# Altium project ADRF6510.PrjPcb
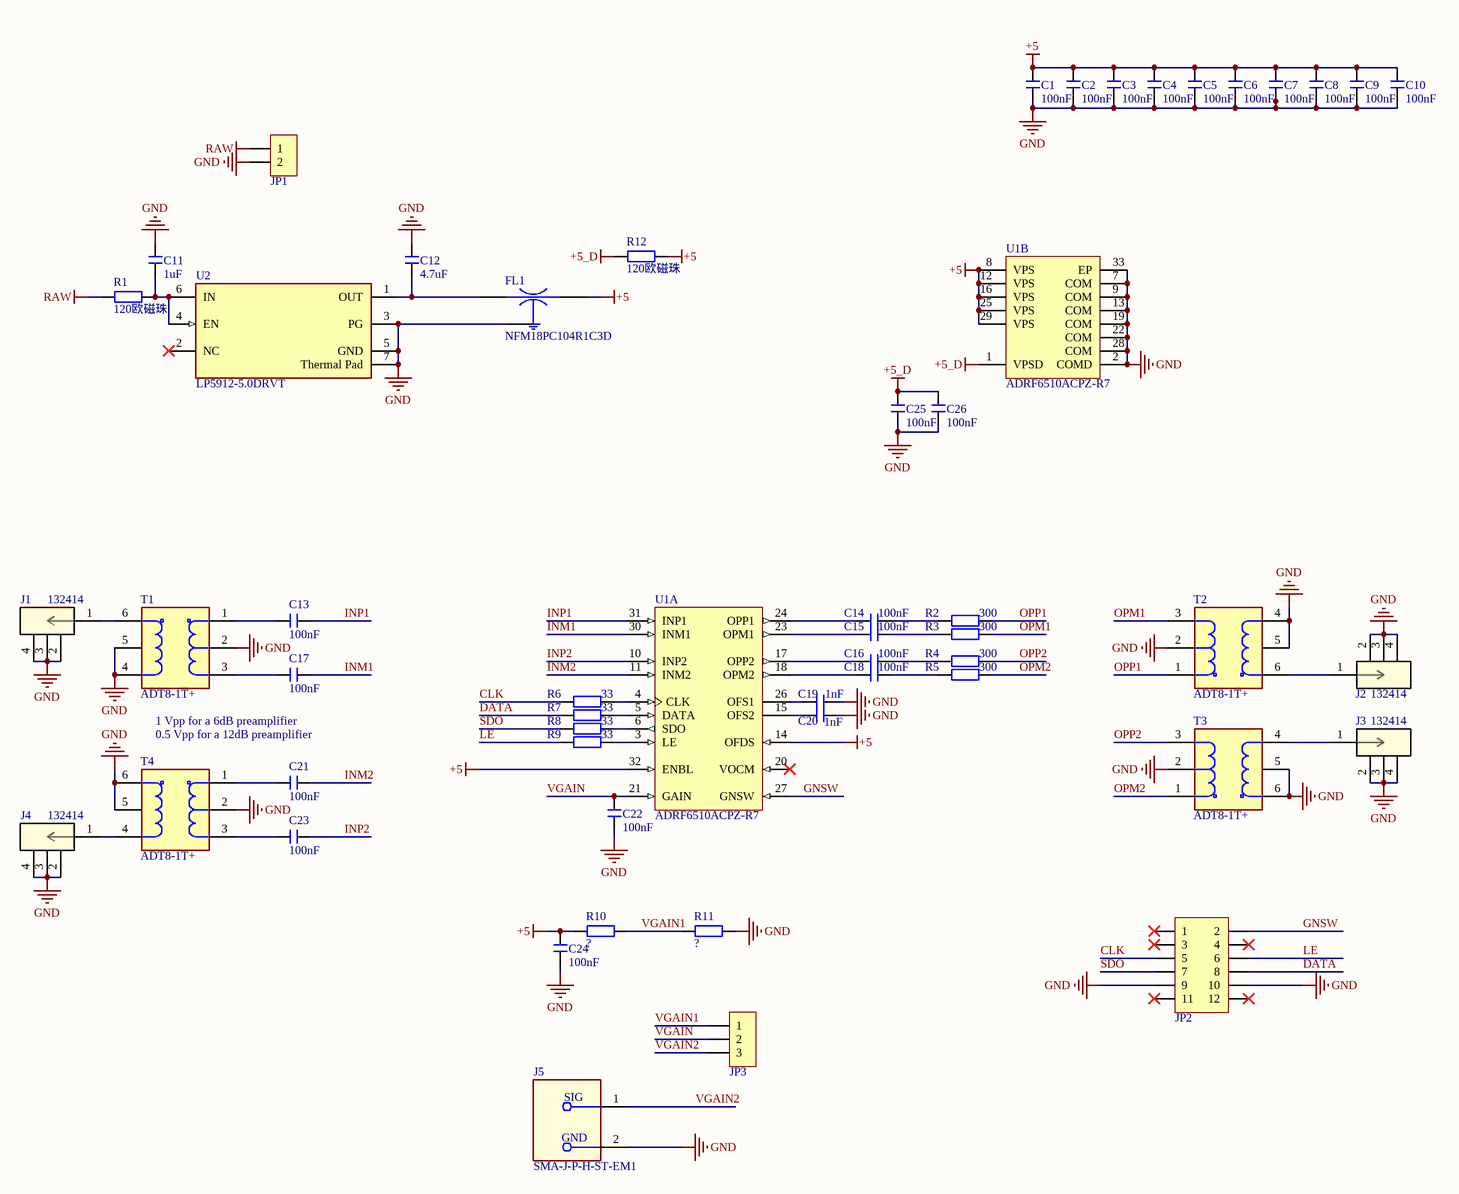
[diagram p0: ADRF6510.SchDoc]
1 sheet, 53 parts. Net scope: global (net labels, ports and power ports of the same name join across sheets).
Board file: ADRF6510.PcbDoc

## Sheet ADRF6510.SchDoc
size A2; SheetNumber: 1; SheetTotal: 1

### Parts
C1  100nF  [C 0402_L]
C2  100nF  [C 0402_L]
C3  100nF  [C 0402_L]
C4  100nF  [C 0402_L]
C5  100nF  [C 0402_L]
C6  100nF  [C 0402_L]
C7  100nF  [C 0402_L]
C8  100nF  [C 0402_L]
C9  100nF  [C 0402_L]
C10  100nF  [C 0402_L]
C11  1uF  [C 0603_L]
C12  4.7uF  [C 0603_L]
C13  100nF  [C 0402_L]
C14  100nF  [C 0402_L]
C15  100nF  [C 0402_L]
C16  100nF  [C 0402_L]
C17  100nF  [C 0402_L]
C18  100nF  [C 0402_L]
C19  1nF  [C 0402_L]
C20  1nF  [C 0402_L]
C21  100nF  [C 0402_L]
C22  100nF  [C 0402_L]
C23  100nF  [C 0402_L]
C24  100nF  [C 0402_L]
C25  100nF  [C 0402_L]
C26  100nF  [C 0402_L]
FL1  NFM18PC104R1C3D  [FIL_NFM18PC104R1C3D]
J1  132414  [CONN_132414_AMP]
J2  132414  [CONN_132414_AMP]
J3  132414  [CONN_132414_AMP]
J4  132414  [CONN_132414_AMP]
J5  SMA-J-P-H-ST-EM1  [FP-SMA-J-P-H-ST-EM1-MFG]
JP1  HDR-1X2  [KF2510-LI-2P]  (value not drawn)
JP2  Header 6X2  [HDR2.54-WI-2x6P]  (value not drawn)
JP3  HDR-1X3  [HDR2.54-LI-3P]  (value not drawn)
R1  120欧磁珠  [R 0603_L]
R2  300  [R 0402_L]
R3  300  [R 0402_L]
R4  300  [R 0402_L]
R5  300  [R 0402_L]
R6  33  [R 0402_L]
R7  33  [R 0402_L]
R8  33  [R 0402_L]
R9  33  [R 0402_L]
R10  ?  [R 0603_L]
R11  ?  [R 0603_L]
R12  120欧磁珠  [R 0603_L]
T1  ADT8-1T+  [ADT8-1T+]
T2  ADT8-1T+  [ADT8-1T+]
T3  ADT8-1T+  [ADT8-1T+]
T4  ADT8-1T+  [ADT8-1T+]
U1  ADRF6510ACPZ-R7  [ADI-CP-32-2_N]  (parts A,B of 2)
U2  LP5912-5.0DRVT  [FP-DRV0006A-MFG]

### Nets
+5: C1.2 C2.2 C3.2 C4.2 C5.2 C6.2 C7.2 C8.2 C9.2 C10.2 C24.2 FL1.3(OUT) R10.1 R12.2 U1.8(VPS) U1.12(VPS) U1.14(OFDS) U1.16(VPS) U1.25(VPS) U1.29(VPS) U1.32(ENBL)
+5_D: C25.2 C26.2 R12.1 U1.1(VPSD)
GND: C1.1 C2.1 C3.1 C4.1 C5.1 C6.1 C7.1 C8.1 C9.1 C10.1 C11.2 C12.2 C19.2 C20.2 C22.1 C24.1 C25.1 C26.1 FL1.2(GND) J1.2 J1.3 J1.4 J2.2 J2.3 J2.4 J3.2 J3.3 J3.4 J4.2 J4.3 J4.4 J5.2(MNT_1) JP1.2 JP2.9 JP2.10 R11.2 T1.2(SECONDARY) T1.4(PRIMARY) T1.5(NC) T2.2(SECONDARY) T2.4(PRIMARY) T2.5(NC) T3.2(SECONDARY) T3.5(NC) T3.6(PRIMARY_DOT) T4.2(SECONDARY) T4.5(NC) T4.6(PRIMARY_DOT) U1.2(COMD) U1.7(COM) U1.9(COM) U1.13(COM) U1.19(COM) U1.22(COM) U1.28(COM) U1.33(EP) U2.3(PG) U2.5(GND) U2.7(Thermal_Pad)
RAW: JP1.1 R1.1
CLK: JP2.5 R6.1
DATA: JP2.8 R7.1
GNSW: JP2.2 U1.27(GNSW)
INM1: C17.1 U1.30(INM1)
INM2: C21.1 U1.11(INM2)
INP1: C13.1 U1.31(INP1)
INP2: C23.1 U1.10(INP2)
LE: JP2.6 R9.1
OPM1: R3.2 T2.3(SECONDARY_MID)
OPM2: R5.2 T3.1(SECONDARY_DOT)
OPP1: R2.2 T2.1(SECONDARY_DOT)
OPP2: R4.2 T3.3(SECONDARY_MID)
SDO: JP2.7 R8.1
VGAIN: C22.2 JP3.2 U1.21(GAIN)
VGAIN1: JP3.1 R10.2 R11.1
VGAIN2: J5.1 JP3.3
NetC11_1: C11.1 R1.2 U2.4(EN) U2.6(IN)
NetC12_1: C12.1 FL1.1(IN) U2.1(OUT)
NetC13_2: C13.2 T1.1(SECONDARY_DOT)
NetC14_1: C14.1 U1.24(OPP1)
NetC14_2: C14.2 R2.1
NetC15_1: C15.1 U1.23(OPM1)
NetC15_2: C15.2 R3.1
NetC16_1: C16.1 U1.17(OPP2)
NetC16_2: C16.2 R4.1
NetC17_2: C17.2 T1.3(SECONDARY_MID)
NetC18_1: C18.1 U1.18(OPM2)
NetC18_2: C18.2 R5.1
NetC19_1: C19.1 U1.26(OFS1)
NetC20_1: C20.1 U1.15(OFS2)
NetC21_2: C21.2 T4.1(SECONDARY_DOT)
NetC23_2: C23.2 T4.3(SECONDARY_MID)
NetJ1_1: J1.1 T1.6(PRIMARY_DOT)
NetJ2_1: J2.1 T2.6(PRIMARY_DOT)
NetJ3_1: J3.1 T3.4(PRIMARY)
NetJ4_1: J4.1 T4.4(PRIMARY)
NetR6_2: R6.2 U1.4(CLK)
NetR7_2: R7.2 U1.5(DATA)
NetR8_2: R8.2 U1.6(SDO)
NetR9_2: R9.2 U1.3(LE)

Not connected (* = marked no-connect by the designer): JP2 1* 3* 4* 11* 12*; U1 20(VOCM)*; U2 2(NC)*

### Notes on the sheet
- 1 Vpp for a 6dB preamplifier
- 0.5 Vpp for a 12dB preamplifier
- (in symbol CMP-02754-000006-1) SIG; GND

### Library data of the parts
C1-C26 = C: 贴片电容; 淘宝ID: 小糖豆的小窝窝; BOM名称: 贴片电容; 下单链接: https://item.taobao.com/item.htm?ft=t&id=613637044352
FL1 = NFM18PC104R1C3D: SMD Capacitor with Capacitance: 0.10uF Tol. 20%. Rated Voltage: 16Vdc; MF: Murata; Digi-Key_Part_Number: 490-6969-1-ND; SnapEDA_Link: https://www.snapeda.com/parts/NFM18PC104R1C3D/Murata/view-part/4375738/?ref=snap; Package: NONSTANDARD; MP: NFM18PC104R1C3D; Digi-Key_Purchase_URL: https://www.digikey.com/product-detail/en/murata-electronics/NFM18PC104R1C3D/490-6969-1-ND/3846166?utm_source=snapeda&utm_medium=aggregator&utm_campaign=symbol; Value: *
J1-J4 = 132414: No Description Available; Mfr_Name: Amphenol ICC; Copyright: Copyright (C) 2022 Ultra Librarian. All rights reserved.; Manufacturer_Part_Number: 132414; RefDes: RefDes; Type: DEV
J5 = CMP-02754-000006-1: CONN SMA JACK STR 50OHM EDGE MNT; Center Contact Plating: Gold; Voltage Rating: 335V; Impedance: 50R; Max Frequency: 6GHz; Body Material: Brass; Dielectric Material: PTFE; Connector Type: SMA; Series: SMA; Fastening Type: Threaded; Depth: 13.33mm; Max Operating Temperature: 125°C; Termination: Solder; Length: 6.35mm; Radiation Hardening: No; RoHS Compliant: Yes; Insulation Material: Polytetrafluoroethylene; Min Operating Temperature: -65°C; Packaging: Tray; Housing Color: Gold; Body Plating: Gold; Mount: Edge; Contact Material: Copper; Orientation: Straight; Package Quantity: 1; Contact Plating: Gold; Case/Package: SMA
JP1 = Header 2: 2P接插件; 淘宝ID: 小糖豆的小窝窝; BOM名称: 2P接插件; 下单链接: https://item.taobao.com/item.htm?ft=t&id=613637044352
JP2 = Header  6X2: 6*2P接插件; 淘宝ID: 小糖豆的小窝窝; BOM名称: 6*2P接插件; 下单链接: https://item.taobao.com/item.htm?ft=t&id=613637044352
JP3 = Header 3: 3P接插件; 淘宝ID: 小糖豆的小窝窝; BOM名称: 3P接插件; 下单链接: https://item.taobao.com/item.htm?ft=t&id=613637044352
R1-R12 = R: 贴片电阻; 淘宝ID: 小糖豆的小窝窝; BOM名称: 贴片电阻; 下单链接: https://item.taobao.com/item.htm?ft=t&id=613637044352
T1-T4 = CMP-00025-00008-6: RF Transformer, 50 ohm, 8.0: 1, 0.10-130 MHz, SMT; RoHS Compliant: Yes
U1 = ADRF510ACPZ: 30 MHz Dual Programmable Filters and Variable Gain Amplifiers, 2 Channels, 4.5 V to 5.5 V, CP32-2-2, 1500 Reel, Pb-Free; Gain Low End: -5dB; RF Frquency Range (MHz): 30MHz; Gain High End: 45dB; Number of Channels: 2; Max Pos Supply: 5.5V; Gain Control: Analog; Output IP3: 25dBm; Supply Current: 264mA; ComponentLink2URL: http://www.analog.com/static/imported-files/data_sheets/ADRF6510.pdf; ComponentLink3URL: http://www.analog.com/static/imported-files/packages/414143737956480539664569CP_32_2.pdf; ComponentLink1URL: www.analog.com; PackageDescription: 32-Lead Lead Frame Chip Scale Package [LFCSP_VQ]; ComponentLink1Description: Manufacturer URL; ComponentLink3Description: Package Specification; PackageVersion: Jan-2005; Code_JEDEC: MO-220-VHHD-2; PackageReference: CP-32-2; ComponentLink2Description: Datasheet; DatasheetVersion: Rev. A
U2 = LP5912DRVT: IC REG LINEAR 500MA 6SON; Dropout Voltage: 950mV; Quiescent Current: 30uA; Output Voltage: 3.3V; Number of Regulators: 1; Min Operating Temperature: -40°C; Number of Pins: 6; Max Operating Temperature: 125°C; RoHS Compliant: Yes; Packaging: Tape and Reel; Output Current: 500mA; Mount: Surface Mount; Lead Free: Lead Free